# EAGLE schematic Servo_Cape (EAGLE 7.7.0)
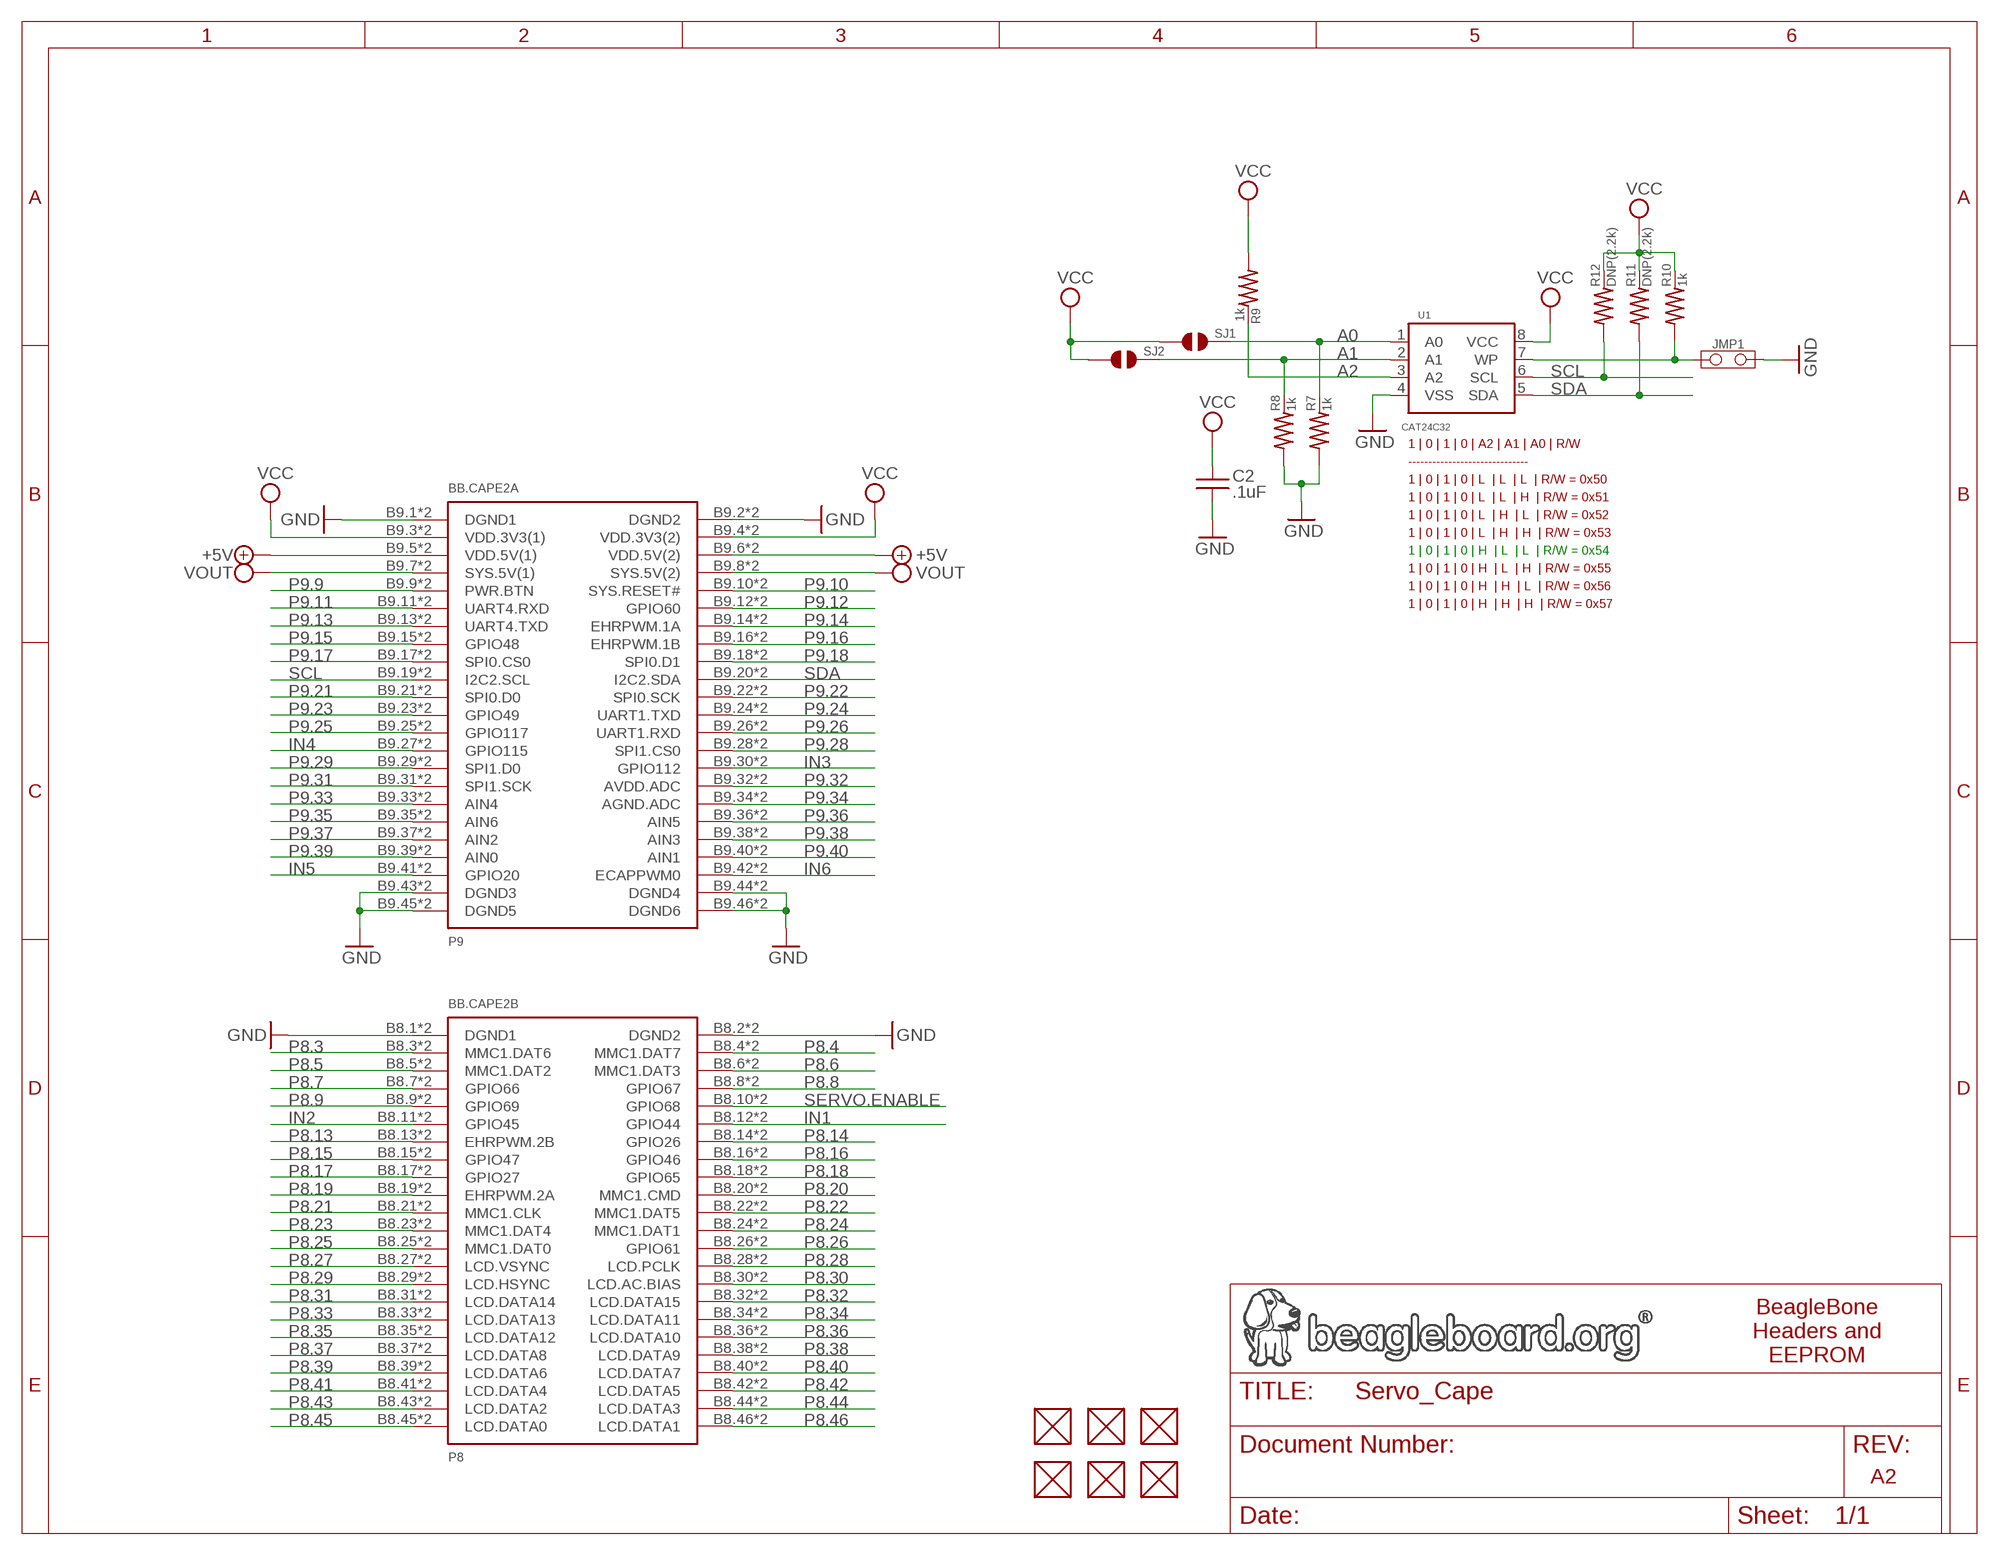
[diagram p0: schematic, sheet 1, part 1 of 2]
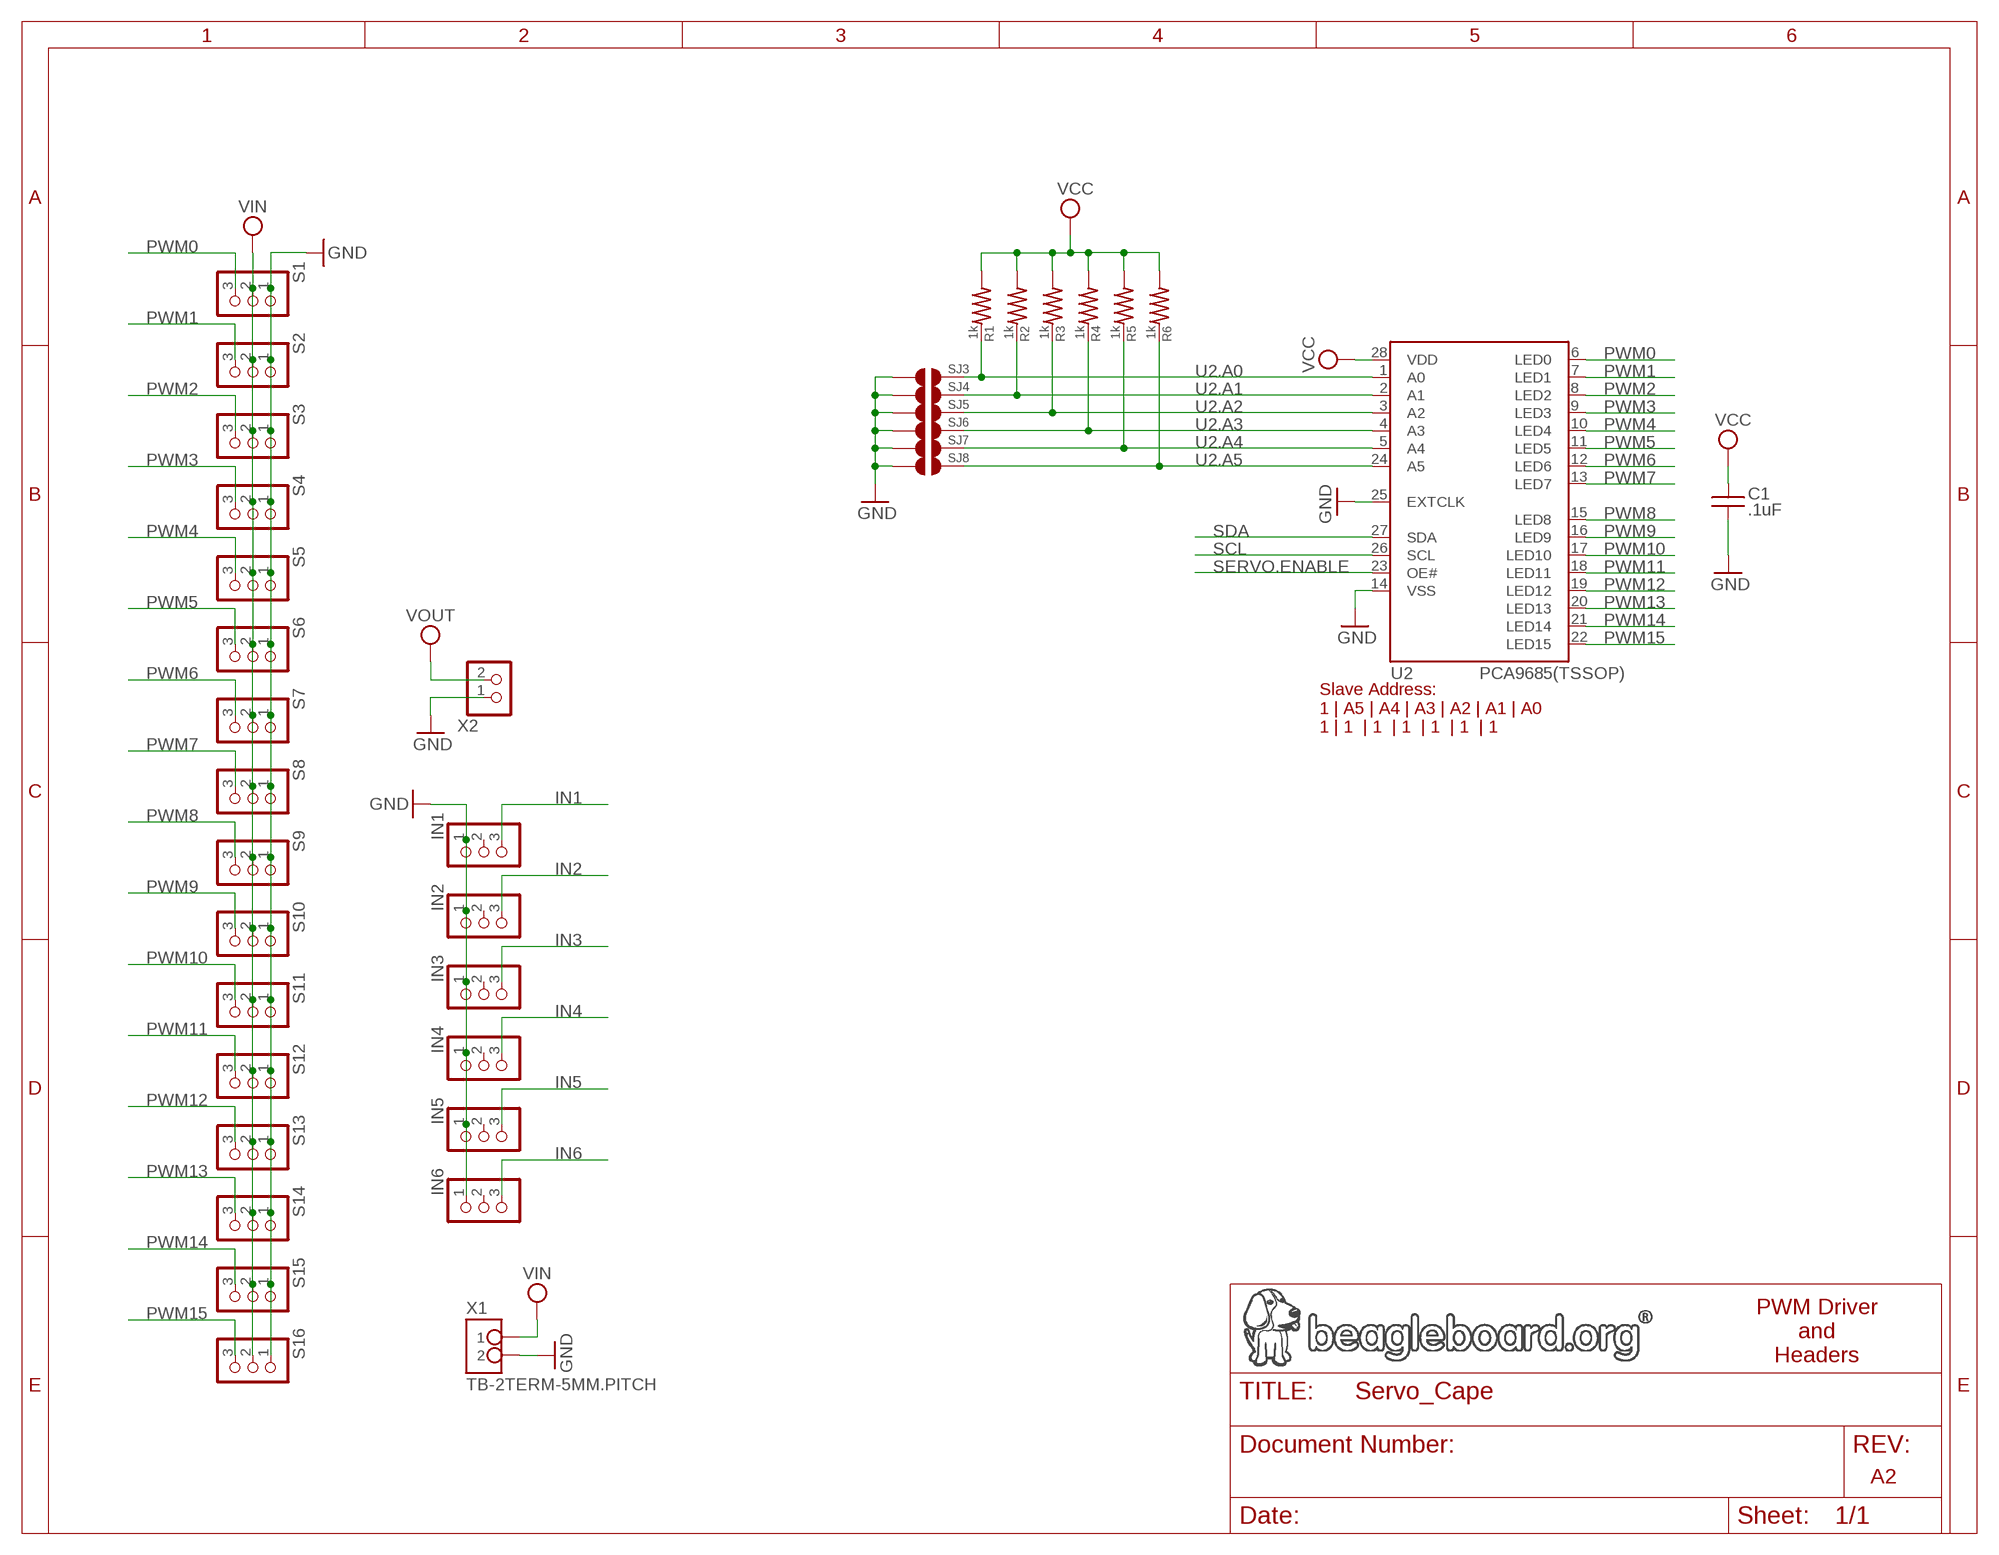
[diagram p1: schematic, sheet 1, part 2 of 2]

## Parts
BB.CAPE2  BEAGLEBONE.CAPE.TOP/BOTTOM-PADS  [BEAGLEBONE.CAPE.TOP/BOTTOM-PADS]
C1  .1uF  CAPACITOR-(INCH)-0402  [0402]
C2  .1uF  CAPACITOR-(INCH)-0402  [0402]
FUD1  FIDUCIAL  [FIDUCIAL_40MIL]
FUD2  FIDUCIAL  [FIDUCIAL_40MIL]
FUD3  FIDUCIAL  [FIDUCIAL_40MIL]
FUD4  FIDUCIAL  [FIDUCIAL_40MIL]
FUD5  FIDUCIAL  [FIDUCIAL_40MIL]
FUD6  FIDUCIAL  [FIDUCIAL_40MIL]
IN1  1X3-(INCH)-0.1-TH-(35-MIL.DIA)  [TH-1X3-(35-MIL.DIA)]
IN2  1X3-(INCH)-0.1-TH-(35-MIL.DIA)  [TH-1X3-(35-MIL.DIA)]
IN3  1X3-(INCH)-0.1-TH-(35-MIL.DIA)  [TH-1X3-(35-MIL.DIA)]
IN4  1X3-(INCH)-0.1-TH-(35-MIL.DIA)  [TH-1X3-(35-MIL.DIA)]
IN5  1X3-(INCH)-0.1-TH-(35-MIL.DIA)  [TH-1X3-(35-MIL.DIA)]
IN6  1X3-(INCH)-0.1-TH-(35-MIL.DIA)  [TH-1X3-(35-MIL.DIA)]
JMP1  JUMPER-(X2)  [JUMPER-(X2)]
R1  1k  RESISTOR-(INCH)-0402  [0402]
R2  1k  RESISTOR-(INCH)-0402  [0402]
R3  1k  RESISTOR-(INCH)-0402  [0402]
R4  1k  RESISTOR-(INCH)-0402  [0402]
R5  1k  RESISTOR-(INCH)-0402  [0402]
R6  1k  RESISTOR-(INCH)-0402  [0402]
R7  1k  RESISTOR-(INCH)-0402  [0402]
R8  1k  RESISTOR-(INCH)-0402  [0402]
R9  1k  RESISTOR-(INCH)-0402  [0402]
R10  1k  RESISTOR-(INCH)-0402  [0402]
R11  DNP(2.2k)  RESISTOR-(INCH)-0402  [0402]
R12  DNP(2.2k)  RESISTOR-(INCH)-0402  [0402]
S1  1X3-(INCH)-0.1-TH-(35-MIL.DIA)  [TH-1X3-(35-MIL.DIA)]
S2  1X3-(INCH)-0.1-TH-(35-MIL.DIA)  [TH-1X3-(35-MIL.DIA)]
S3  1X3-(INCH)-0.1-TH-(35-MIL.DIA)  [TH-1X3-(35-MIL.DIA)]
S4  1X3-(INCH)-0.1-TH-(35-MIL.DIA)  [TH-1X3-(35-MIL.DIA)]
S5  1X3-(INCH)-0.1-TH-(35-MIL.DIA)  [TH-1X3-(35-MIL.DIA)]
S6  1X3-(INCH)-0.1-TH-(35-MIL.DIA)  [TH-1X3-(35-MIL.DIA)]
S7  1X3-(INCH)-0.1-TH-(35-MIL.DIA)  [TH-1X3-(35-MIL.DIA)]
S8  1X3-(INCH)-0.1-TH-(35-MIL.DIA)  [TH-1X3-(35-MIL.DIA)]
S9  1X3-(INCH)-0.1-TH-(35-MIL.DIA)  [TH-1X3-(35-MIL.DIA)]
S10  1X3-(INCH)-0.1-TH-(35-MIL.DIA)  [TH-1X3-(35-MIL.DIA)]
S11  1X3-(INCH)-0.1-TH-(35-MIL.DIA)  [TH-1X3-(35-MIL.DIA)]
S12  1X3-(INCH)-0.1-TH-(35-MIL.DIA)  [TH-1X3-(35-MIL.DIA)]
S13  1X3-(INCH)-0.1-TH-(35-MIL.DIA)  [TH-1X3-(35-MIL.DIA)]
S14  1X3-(INCH)-0.1-TH-(35-MIL.DIA)  [TH-1X3-(35-MIL.DIA)]
S15  1X3-(INCH)-0.1-TH-(35-MIL.DIA)  [TH-1X3-(35-MIL.DIA)]
S16  1X3-(INCH)-0.1-TH-(35-MIL.DIA)  [TH-1X3-(35-MIL.DIA)]
SJ1  SOLDER.JOINT-(INCH)-0402  [SOLDER.JOINT(0402)]
SJ2  SOLDER.JOINT-(INCH)-0402  [SOLDER.JOINT(0402)]
SJ3  SOLDER.JOINT-(INCH)-0402  [SOLDER.JOINT(0402)]
SJ4  SOLDER.JOINT-(INCH)-0402  [SOLDER.JOINT(0402)]
SJ5  SOLDER.JOINT-(INCH)-0402  [SOLDER.JOINT(0402)]
SJ6  SOLDER.JOINT-(INCH)-0402  [SOLDER.JOINT(0402)]
SJ7  SOLDER.JOINT-(INCH)-0402  [SOLDER.JOINT(0402)]
SJ8  SOLDER.JOINT-(INCH)-0402  [SOLDER.JOINT(0402)]
U1  CAT24C32  [UDFN8,2X3(ON-SEMI)]
U2  PCA9685(TSSOP)  [TSSOP28(NXP)]
X1  TB-2TERM-5MM.PITCH  [TERMINAL.BLOCK-2TERM-5MM.PITCH]
X2  1X2-(INCH)-0.1-TH-(35-MIL.DIA)  [TH-1X2-(35-MIL.DIA)]

## Nets
+5V [power]: BB.CAPE2.B9.5(A:VDD.5V(1)) BB.CAPE2.B9.6(A:VDD.5V(2)) BB.CAPE2.T9.5(A:VDD.5V(1)) BB.CAPE2.T9.6(A:VDD.5V(2))
A0: R7.2 SJ1.2 U1.1(A0)
A1: R8.2 SJ2.2 U1.2(A1)
A2: R9.2 U1.3(A2)
GND: BB.CAPE2.B8.1(B:DGND1) BB.CAPE2.B8.2(B:DGND2) BB.CAPE2.B9.1(A:DGND1) BB.CAPE2.B9.2(A:DGND2) BB.CAPE2.B9.43(A:DGND3) BB.CAPE2.B9.44(A:DGND4) BB.CAPE2.B9.45(A:DGND5) BB.CAPE2.B9.46(A:DGND6) BB.CAPE2.T8.1(B:DGND1) BB.CAPE2.T8.2(B:DGND2) BB.CAPE2.T9.1(A:DGND1) BB.CAPE2.T9.2(A:DGND2) BB.CAPE2.T9.43(A:DGND3) BB.CAPE2.T9.44(A:DGND4) BB.CAPE2.T9.45(A:DGND5) BB.CAPE2.T9.46(A:DGND6) C1.2 C2.2 IN1.1 IN2.1 IN3.1 IN4.1 IN5.1 IN6.1 JMP1.2 R7.1 R8.1 S1.1 S2.1 S3.1 S4.1 S5.1 S6.1 S7.1 S8.1 S9.1 S10.1 S11.1 S12.1 S13.1 S14.1 S15.1 S16.1 SJ3.1 SJ4.1 SJ5.1 SJ6.1 SJ7.1 SJ8.1 U1.4(VSS) U2.14(VSS) U2.25(EXTCLK) X1.2 X2.1
IN1: BB.CAPE2.B8.12(B:GPIO44) BB.CAPE2.T8.12(B:GPIO44) IN1.3
IN2: BB.CAPE2.B8.11(B:GPIO45) BB.CAPE2.T8.11(B:GPIO45) IN2.3
IN3: BB.CAPE2.B9.30(A:GPIO112) BB.CAPE2.T9.30(A:GPIO112) IN3.3
IN4: BB.CAPE2.B9.27(A:GPIO115) BB.CAPE2.T9.27(A:GPIO115) IN4.3
IN5: BB.CAPE2.B9.41(A:GPIO20) BB.CAPE2.T9.41(A:GPIO20) IN5.3
IN6: BB.CAPE2.B9.42(A:ECAPPWM0) BB.CAPE2.T9.42(A:ECAPPWM0) IN6.3
P8.3: BB.CAPE2.B8.3(B:MMC1.DAT6) BB.CAPE2.T8.3(B:MMC1.DAT6)
P8.4: BB.CAPE2.B8.4(B:MMC1.DAT7) BB.CAPE2.T8.4(B:MMC1.DAT7)
P8.5: BB.CAPE2.B8.5(B:MMC1.DAT2) BB.CAPE2.T8.5(B:MMC1.DAT2)
P8.6: BB.CAPE2.B8.6(B:MMC1.DAT3) BB.CAPE2.T8.6(B:MMC1.DAT3)
P8.7: BB.CAPE2.B8.7(B:GPIO66) BB.CAPE2.T8.7(B:GPIO66)
P8.8: BB.CAPE2.B8.8(B:GPIO67) BB.CAPE2.T8.8(B:GPIO67)
P8.9: BB.CAPE2.B8.9(B:GPIO69) BB.CAPE2.T8.9(B:GPIO69)
P8.13: BB.CAPE2.B8.13(B:EHRPWM.2B) BB.CAPE2.T8.13(B:EHRPWM.2B)
P8.14: BB.CAPE2.B8.14(B:GPIO26) BB.CAPE2.T8.14(B:GPIO26)
P8.15: BB.CAPE2.B8.15(B:GPIO47) BB.CAPE2.T8.15(B:GPIO47)
P8.16: BB.CAPE2.B8.16(B:GPIO46) BB.CAPE2.T8.16(B:GPIO46)
P8.17: BB.CAPE2.B8.17(B:GPIO27) BB.CAPE2.T8.17(B:GPIO27)
P8.18: BB.CAPE2.B8.18(B:GPIO65) BB.CAPE2.T8.18(B:GPIO65)
P8.19: BB.CAPE2.B8.19(B:EHRPWM.2A) BB.CAPE2.T8.19(B:EHRPWM.2A)
P8.20: BB.CAPE2.B8.20(B:MMC1.CMD) BB.CAPE2.T8.20(B:MMC1.CMD)
P8.21: BB.CAPE2.B8.21(B:MMC1.CLK) BB.CAPE2.T8.21(B:MMC1.CLK)
P8.22: BB.CAPE2.B8.22(B:MMC1.DAT5) BB.CAPE2.T8.22(B:MMC1.DAT5)
P8.23: BB.CAPE2.B8.23(B:MMC1.DAT4) BB.CAPE2.T8.23(B:MMC1.DAT4)
P8.24: BB.CAPE2.B8.24(B:MMC1.DAT1) BB.CAPE2.T8.24(B:MMC1.DAT1)
P8.25: BB.CAPE2.B8.25(B:MMC1.DAT0) BB.CAPE2.T8.25(B:MMC1.DAT0)
P8.26: BB.CAPE2.B8.26(B:GPIO61) BB.CAPE2.T8.26(B:GPIO61)
P8.27: BB.CAPE2.B8.27(B:LCD.VSYNC) BB.CAPE2.T8.27(B:LCD.VSYNC)
P8.28: BB.CAPE2.B8.28(B:LCD.PCLK) BB.CAPE2.T8.28(B:LCD.PCLK)
P8.29: BB.CAPE2.B8.29(B:LCD.HSYNC) BB.CAPE2.T8.29(B:LCD.HSYNC)
P8.30: BB.CAPE2.B8.30(B:LCD.AC.BIAS) BB.CAPE2.T8.30(B:LCD.AC.BIAS)
P8.31: BB.CAPE2.B8.31(B:LCD.DATA14) BB.CAPE2.T8.31(B:LCD.DATA14)
P8.32: BB.CAPE2.B8.32(B:LCD.DATA15) BB.CAPE2.T8.32(B:LCD.DATA15)
P8.33: BB.CAPE2.B8.33(B:LCD.DATA13) BB.CAPE2.T8.33(B:LCD.DATA13)
P8.34: BB.CAPE2.B8.34(B:LCD.DATA11) BB.CAPE2.T8.34(B:LCD.DATA11)
P8.35: BB.CAPE2.B8.35(B:LCD.DATA12) BB.CAPE2.T8.35(B:LCD.DATA12)
P8.36: BB.CAPE2.B8.36(B:LCD.DATA10) BB.CAPE2.T8.36(B:LCD.DATA10)
P8.37: BB.CAPE2.B8.37(B:LCD.DATA8) BB.CAPE2.T8.37(B:LCD.DATA8)
P8.38: BB.CAPE2.B8.38(B:LCD.DATA9) BB.CAPE2.T8.38(B:LCD.DATA9)
P8.39: BB.CAPE2.B8.39(B:LCD.DATA6) BB.CAPE2.T8.39(B:LCD.DATA6)
P8.40: BB.CAPE2.B8.40(B:LCD.DATA7) BB.CAPE2.T8.40(B:LCD.DATA7)
P8.41: BB.CAPE2.B8.41(B:LCD.DATA4) BB.CAPE2.T8.41(B:LCD.DATA4)
P8.42: BB.CAPE2.B8.42(B:LCD.DATA5) BB.CAPE2.T8.42(B:LCD.DATA5)
P8.43: BB.CAPE2.B8.43(B:LCD.DATA2) BB.CAPE2.T8.43(B:LCD.DATA2)
P8.44: BB.CAPE2.B8.44(B:LCD.DATA3) BB.CAPE2.T8.44(B:LCD.DATA3)
P8.45: BB.CAPE2.B8.45(B:LCD.DATA0) BB.CAPE2.T8.45(B:LCD.DATA0)
P8.46: BB.CAPE2.B8.46(B:LCD.DATA1) BB.CAPE2.T8.46(B:LCD.DATA1)
P9.9: BB.CAPE2.B9.9(A:PWR.BTN) BB.CAPE2.T9.9(A:PWR.BTN)
P9.10: BB.CAPE2.B9.10(A:SYS.RESET#) BB.CAPE2.T9.10(A:SYS.RESET#)
P9.11: BB.CAPE2.B9.11(A:UART4.RXD) BB.CAPE2.T9.11(A:UART4.RXD)
P9.12: BB.CAPE2.B9.12(A:GPIO60) BB.CAPE2.T9.12(A:GPIO60)
P9.13: BB.CAPE2.B9.13(A:UART4.TXD) BB.CAPE2.T9.13(A:UART4.TXD)
P9.14: BB.CAPE2.B9.14(A:EHRPWM.1A) BB.CAPE2.T9.14(A:EHRPWM.1A)
P9.15: BB.CAPE2.B9.15(A:GPIO48) BB.CAPE2.T9.15(A:GPIO48)
P9.16: BB.CAPE2.B9.16(A:EHRPWM.1B) BB.CAPE2.T9.16(A:EHRPWM.1B)
P9.17: BB.CAPE2.B9.17(A:SPI0.CS0) BB.CAPE2.T9.17(A:SPI0.CS0)
P9.18: BB.CAPE2.B9.18(A:SPI0.D1) BB.CAPE2.T9.18(A:SPI0.D1)
P9.21: BB.CAPE2.B9.21(A:SPI0.D0) BB.CAPE2.T9.21(A:SPI0.D0)
P9.22: BB.CAPE2.B9.22(A:SPI0.SCK) BB.CAPE2.T9.22(A:SPI0.SCK)
P9.23: BB.CAPE2.B9.23(A:GPIO49) BB.CAPE2.T9.23(A:GPIO49)
P9.24: BB.CAPE2.B9.24(A:UART1.TXD) BB.CAPE2.T9.24(A:UART1.TXD)
P9.25: BB.CAPE2.B9.25(A:GPIO117) BB.CAPE2.T9.25(A:GPIO117)
P9.26: BB.CAPE2.B9.26(A:UART1.RXD) BB.CAPE2.T9.26(A:UART1.RXD)
P9.28: BB.CAPE2.B9.28(A:SPI1.CS0) BB.CAPE2.T9.28(A:SPI1.CS0)
P9.29: BB.CAPE2.B9.29(A:SPI1.D0) BB.CAPE2.T9.29(A:SPI1.D0)
P9.31: BB.CAPE2.B9.31(A:SPI1.SCK) BB.CAPE2.T9.31(A:SPI1.SCK)
P9.32: BB.CAPE2.B9.32(A:AVDD.ADC) BB.CAPE2.T9.32(A:AVDD.ADC)
P9.33: BB.CAPE2.B9.33(A:AIN4) BB.CAPE2.T9.33(A:AIN4)
P9.34: BB.CAPE2.B9.34(A:AGND.ADC) BB.CAPE2.T9.34(A:AGND.ADC)
P9.35: BB.CAPE2.B9.35(A:AIN6) BB.CAPE2.T9.35(A:AIN6)
P9.36: BB.CAPE2.B9.36(A:AIN5) BB.CAPE2.T9.36(A:AIN5)
P9.37: BB.CAPE2.B9.37(A:AIN2) BB.CAPE2.T9.37(A:AIN2)
P9.38: BB.CAPE2.B9.38(A:AIN3) BB.CAPE2.T9.38(A:AIN3)
P9.39: BB.CAPE2.B9.39(A:AIN0) BB.CAPE2.T9.39(A:AIN0)
P9.40: BB.CAPE2.B9.40(A:AIN1) BB.CAPE2.T9.40(A:AIN1)
PWM0: S1.3 U2.6(LED0)
PWM1: S2.3 U2.7(LED1)
PWM2: S3.3 U2.8(LED2)
PWM3: S4.3 U2.9(LED3)
PWM4: S5.3 U2.10(LED4)
PWM5: S6.3 U2.11(LED5)
PWM6: S7.3 U2.12(LED6)
PWM7: S8.3 U2.13(LED7)
PWM8: S9.3 U2.15(LED8)
PWM9: S10.3 U2.16(LED9)
PWM10: S11.3 U2.17(LED10)
PWM11: S12.3 U2.18(LED11)
PWM12: S13.3 U2.19(LED12)
PWM13: S14.3 U2.20(LED13)
PWM14: S15.3 U2.21(LED14)
PWM15: S16.3 U2.22(LED15)
SCL: BB.CAPE2.B9.19(A:I2C2.SCL) BB.CAPE2.T9.19(A:I2C2.SCL) R12.1 U1.6(SCL) U2.26(SCL)
SDA: BB.CAPE2.B9.20(A:I2C2.SDA) BB.CAPE2.T9.20(A:I2C2.SDA) R11.1 U1.5(SDA) U2.27(SDA)
SERVO.ENABLE: BB.CAPE2.B8.10(B:GPIO68) BB.CAPE2.T8.10(B:GPIO68) U2.23(OE#)
U2.A0: R1.2 SJ3.2 U2.1(A0)
U2.A1: R2.2 SJ4.2 U2.2(A1)
U2.A2: R3.2 SJ5.2 U2.3(A2)
U2.A3: R4.2 SJ6.2 U2.4(A3)
U2.A4: R5.2 SJ7.2 U2.5(A4)
U2.A5: R6.2 SJ8.2 U2.24(A5)
VCC: BB.CAPE2.B9.3(A:VDD.3V3(1)) BB.CAPE2.B9.4(A:VDD.3V3(2)) BB.CAPE2.T9.3(A:VDD.3V3(1)) BB.CAPE2.T9.4(A:VDD.3V3(2)) C1.1 C2.1 R1.1 R2.1 R3.1 R4.1 R5.1 R6.1 R9.1 R10.2 R11.2 R12.2 SJ1.1 SJ2.1 U1.8(VCC) U2.28(VDD)
VIN: S1.2 S2.2 S3.2 S4.2 S5.2 S6.2 S7.2 S8.2 S9.2 S10.2 S11.2 S12.2 S13.2 S14.2 S15.2 S16.2 X1.1
VOUT: BB.CAPE2.B9.7(A:SYS.5V(1)) BB.CAPE2.B9.8(A:SYS.5V(2)) BB.CAPE2.T9.7(A:SYS.5V(1)) BB.CAPE2.T9.8(A:SYS.5V(2)) X2.2
WP: JMP1.1 R10.1 U1.7(WP)
Unconnected: FUD1.P$1 FUD2.P$1 FUD3.P$1 FUD4.P$1 FUD5.P$1 FUD6.P$1 IN1.2 IN2.2 IN3.2 IN4.2 IN5.2 IN6.2

## Notes on the sheet
- 1 | 0 | 1 | 0 | A2 | A1 | A0 | R/W
- ------------------------------
- 1 | 0 | 1 | 0 | L  | L  | L  | R/W = 0x50
- 1 | 0 | 1 | 0 | L  | L  | H  | R/W = 0x51
- 1 | 0 | 1 | 0 | L  | H  | L  | R/W = 0x52
- 1 | 0 | 1 | 0 | L  | H  | H  | R/W = 0x53
- 1 | 0 | 1 | 0 | H  | L  | L  | R/W = 0x54
- 1 | 0 | 1 | 0 | H  | L  | H  | R/W = 0x55
- 1 | 0 | 1 | 0 | H  | H  | L  | R/W = 0x56
- 1 | 0 | 1 | 0 | H  | H  | H  | R/W = 0x57
- Slave Address:
  1 | A5 | A4 | A3 | A2 | A1 | A0
  1 | 1  | 1  | 1  | 1  | 1  | 1
- BeagleBone
  Headers and
  EEPROM
- PWM Driver
  and
  Headers
- A2 | A2

## Library data of the parts
BB.CAPE2 = GHI-Solutions:BEAGLEBONE.CAPE
C1 C2 = GHI-BasicComponents:CAPACITOR-(INCH)-: Basic SMD ceramic capacitors
FUD1-FUD6 = GHI:FIDUCIAL
IN1-IN6 S1-S16 = GHI-Headers:1X3-(INCH)-0.1-
JMP1 = GHI-Headers:JUMPER-(X2)
R1-R12 = GHI-BasicComponents:RESISTOR-(INCH)-: Basic SMD Resistors
SJ1-SJ8 = GHI-Miscellaneous:SOLDER.JOINT-(INCH)-: Solder Joint (Bridge) Pads - For easy solder joining.
U1 = GHI-IC:CAT24C32: 32-Kb I2C CMOS Serial EEPROM
U2 = GHI-IC:PCA9685(TSSOP)
X1 = GHI-Connectors:TB-2TERM-5MM.PITCH
X2 = GHI-Headers:1X2-(INCH)-0.1-